# Altium schematic sheet MicroSpecSensorBoard_PowerSupply_V2_1.SchDoc
size A4
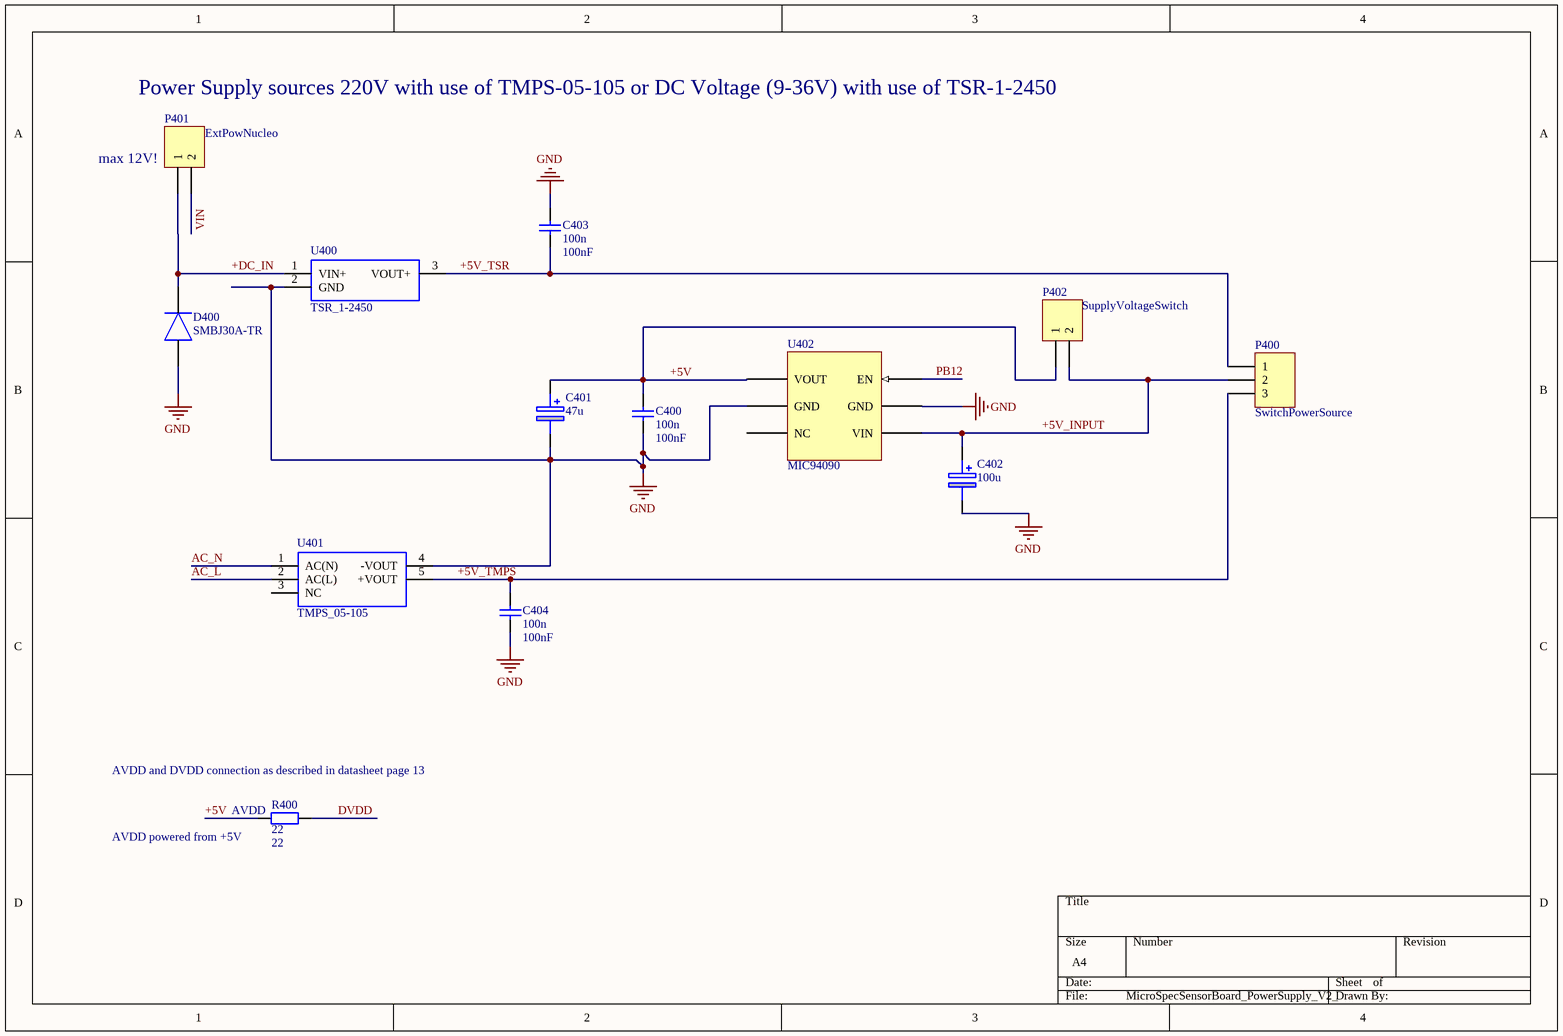
[diagram p0: MicroSpecSensorBoard_PowerSupply_V2_1.SchDoc]

## Parts
C400  100n  value 100nF  [6-0805_L]
C401  47u  [FKV(D)]
C402  100u  [FKV(D)]
C403  100n  value 100nF  [6-0805_L]
C404  100n  value 100nF  [6-0805_L]
D400  SMBJ30A-TR  [DIOM5436X265N]
P400  SwitchPowerSource  [HDR1X3]
P401  ExtPowNucleo  [HDR1X2]
P402  SupplyVoltageSwitch  [HDR1X2]
R400  22  [6-0805_L]
U400  TSR_1-2450  [TSR-1-24120]
U401  TMPS_05-105  [TMPS05-105]
U402  MIC94090  [SOT65P210X110-6N]

## Nets
GND: C400.2 C401.2(-) C402.2(-) C403.1 C404.2 D400.2(A) U400.2(GND) U401.4(-VOUT) U402.2(GND) U402.5(GND)
+5V: C400.1 C401.1(+) P402.1 R400.1 U402.1(VOUT)
+5V_INPUT: C402.1(+) P400.2 P402.2 U402.4(VIN)
+5V_TMPS: C404.1 P400.3 U401.5(+VOUT)
+5V_TSR: C403.2 P400.1 U400.3(VOUT+)
+DC_IN: D400.1(K) P401.1 U400.1(VIN+)
AC_L: U401.2(AC(L))
AC_N: U401.1(AC(N))
DVDD: R400.2
PB12: U402.6(EN)
VIN: P401.2

Not connected (* = marked no-connect by the designer): U401 3(NC); U402 3(NC)

## Notes on the sheet
- Power Supply sources 220V with use of TMPS-05-105 or DC Voltage (9-36V) with use of TSR-1-2450
- (near P401) max 12V!
- (near R400) AVDD and DVDD connection as described in datasheet page 13
- (near R400) AVDD powered from +5V
- (near R400) AVDD

## Library data of the parts
C400 C403 C404 = Cap: Capacitor; Published: 8-Jun-2000; LatestRevisionDate: 17-Jul-2002; LatestRevisionNote: Re-released for DXP Platform.; PackageReference: RAD-0.3; Publisher: Altium Limited; PackageDescription: Radial Cap, Thru-Hole; 2 Leads; 0.3 in Pin Spacing
C401 = EEEFK1J100P: Ecap 47F 63V; Manufacturer_Name: Panasonic; Allied_Number: 70256560; RS Part Number: 7083588P; Manufacturer_Part_Number: EEEFK1J100P; Datasheet Link: http://uk.rs-online.com/web/p/products/7083588P
C402 = EEEFK1J100P: Ecap 100uF 63V; Manufacturer_Name: Panasonic; Allied_Number: 70256560; RS Part Number: 7083588P; Manufacturer_Part_Number: EEEFK1J100P; Datasheet Link: http://uk.rs-online.com/web/p/products/7083588P
D400 = SMBJ30A-TR: TVS Diode Uni-Directional SMBJ30A-TR 64.3V, 600W, SMB 2-Pin; Manufacturer_Name: STMicroelectronics; Allied_Number: 70390510; Geometry.Height: 2.65mm; Manufacturer_Part_Number: SMBJ30A-TR; RS Part Number: 7141048P; RS Price/Stock: http://uk.rs-online.com/web/p/products/7141048P; Allied Price/Stock: http://www.alliedelec.com/stmicroelectronics-smbj30a-tr/70390510/; Arrow Part Number: SMBJ30A-TR; Arrow Price/Stock: https://www.arrow.com/en/products/smbj30a-tr/stmicroelectronics; Datasheet Link: http://www.st.com/web/en/resource/technical/document/datasheet/CD00001366.pdf
P400 = Header 3: Header, 3-Pin; LatestRevisionDate: 17-Jul-2002; LatestRevisionNote: Re-released for DXP Platform.; Publisher: Altium Limited
P401 P402 = Header 2: Header, 2-Pin; LatestRevisionDate: 17-Jul-2002; LatestRevisionNote: Re-released for DXP Platform.; Publisher: Altium Limited
R400 = Res2: Resistor; Published: 8-Jun-2000; LatestRevisionDate: 17-Jul-2002; LatestRevisionNote: Re-released for DXP Platform.; PackageReference: AXIAL-0.4; Publisher: Altium Limited; PackageDescription: Axial Device, Thru-Hole; 2 Leads; 0.4 in Pin Spacing; Value: 22
U400 = TSR_1-2450: Switching Regulator,6.5-32Vin,5Vout 1A Switching Regulator, 6.5 ??? 36V dc Input, 5V Output, 1A; Manufacturer_Name: Traco Power; Manufacturer_Part_Number: TSR 1-2450; RS Part Number: 6664379P; Datasheet Link: http://uk.rs-online.com/web/p/products/6664379P
U401 = TMPS_05-105: AC/DC Power Modules 5W 5Vdc 1000mA AC/DC Power module; Manufacturer_Name: Traco Power; Manufacturer_Part_Number: TMPS 05-105; RS Part Number: 8920630; RS Price/Stock: http://uk.rs-online.com/web/p/products/8920630; Arrow Part Number: TMPS 05-105; Arrow Price/Stock: http://www.arrow.com/en/products/tmps05-105/traco-power; Datasheet Link: http://assets.tracopower.com/20161031120609/TMPS05/documents/tmps05-datasheet.pdf
U402 = MIC94090: high side switch